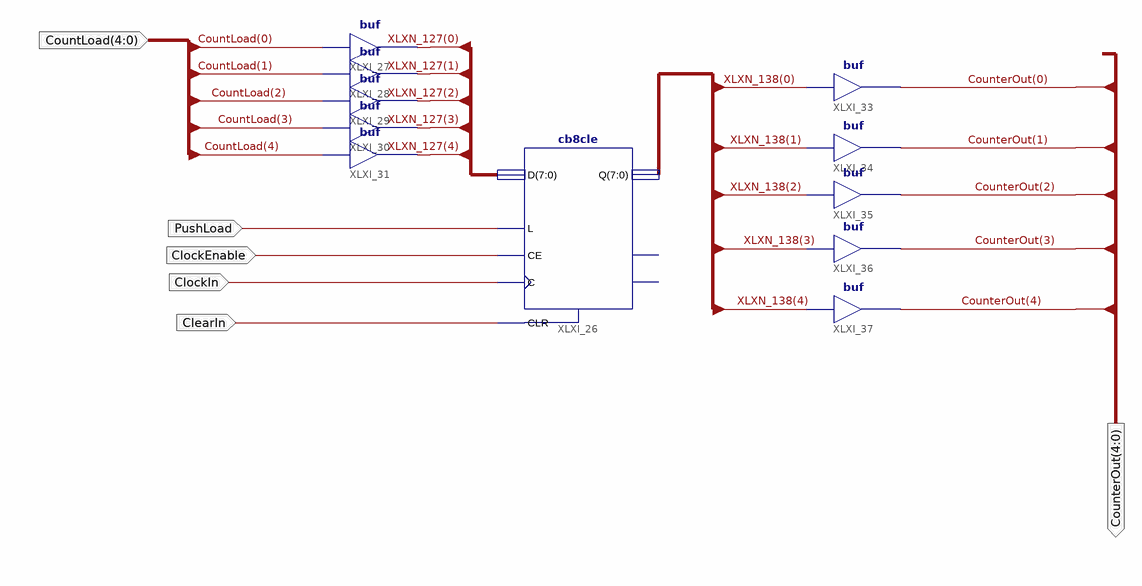
[diagram p0: schematic sheet 1]
// Xilinx ISE schematic ProgramCounter8.sch (spartan3e) as structural Verilog: 11 symbols, 6 ports
module ProgramCounter8 (
  input  [4:0] CountLoad,
  input  ClockEnable,
  input  PushLoad,
  input  ClockIn,
  input  ClearIn,
  output [4:0] CounterOut
);

  wire [7:0] XLXN_127, XLXN_138;

  cb8cle XLXI_26 (
    .C(ClockIn), .CE(ClockEnable), .CLR(ClearIn), .D(XLXN_127), .L(PushLoad), .Q(XLXN_138));  // open: CEO, TC
  buf XLXI_27 (XLXN_127[0], CountLoad[0]);
  buf XLXI_28 (XLXN_127[1], CountLoad[1]);
  buf XLXI_29 (XLXN_127[2], CountLoad[2]);
  buf XLXI_30 (XLXN_127[3], CountLoad[3]);
  buf XLXI_31 (XLXN_127[4], CountLoad[4]);
  buf XLXI_33 (CounterOut[0], XLXN_138[0]);
  buf XLXI_34 (CounterOut[1], XLXN_138[1]);
  buf XLXI_35 (CounterOut[2], XLXN_138[2]);
  buf XLXI_36 (CounterOut[3], XLXN_138[3]);
  buf XLXI_37 (CounterOut[4], XLXN_138[4]);
endmodule
